# EAGLE design M8-Level (EAGLE 9.5.2)
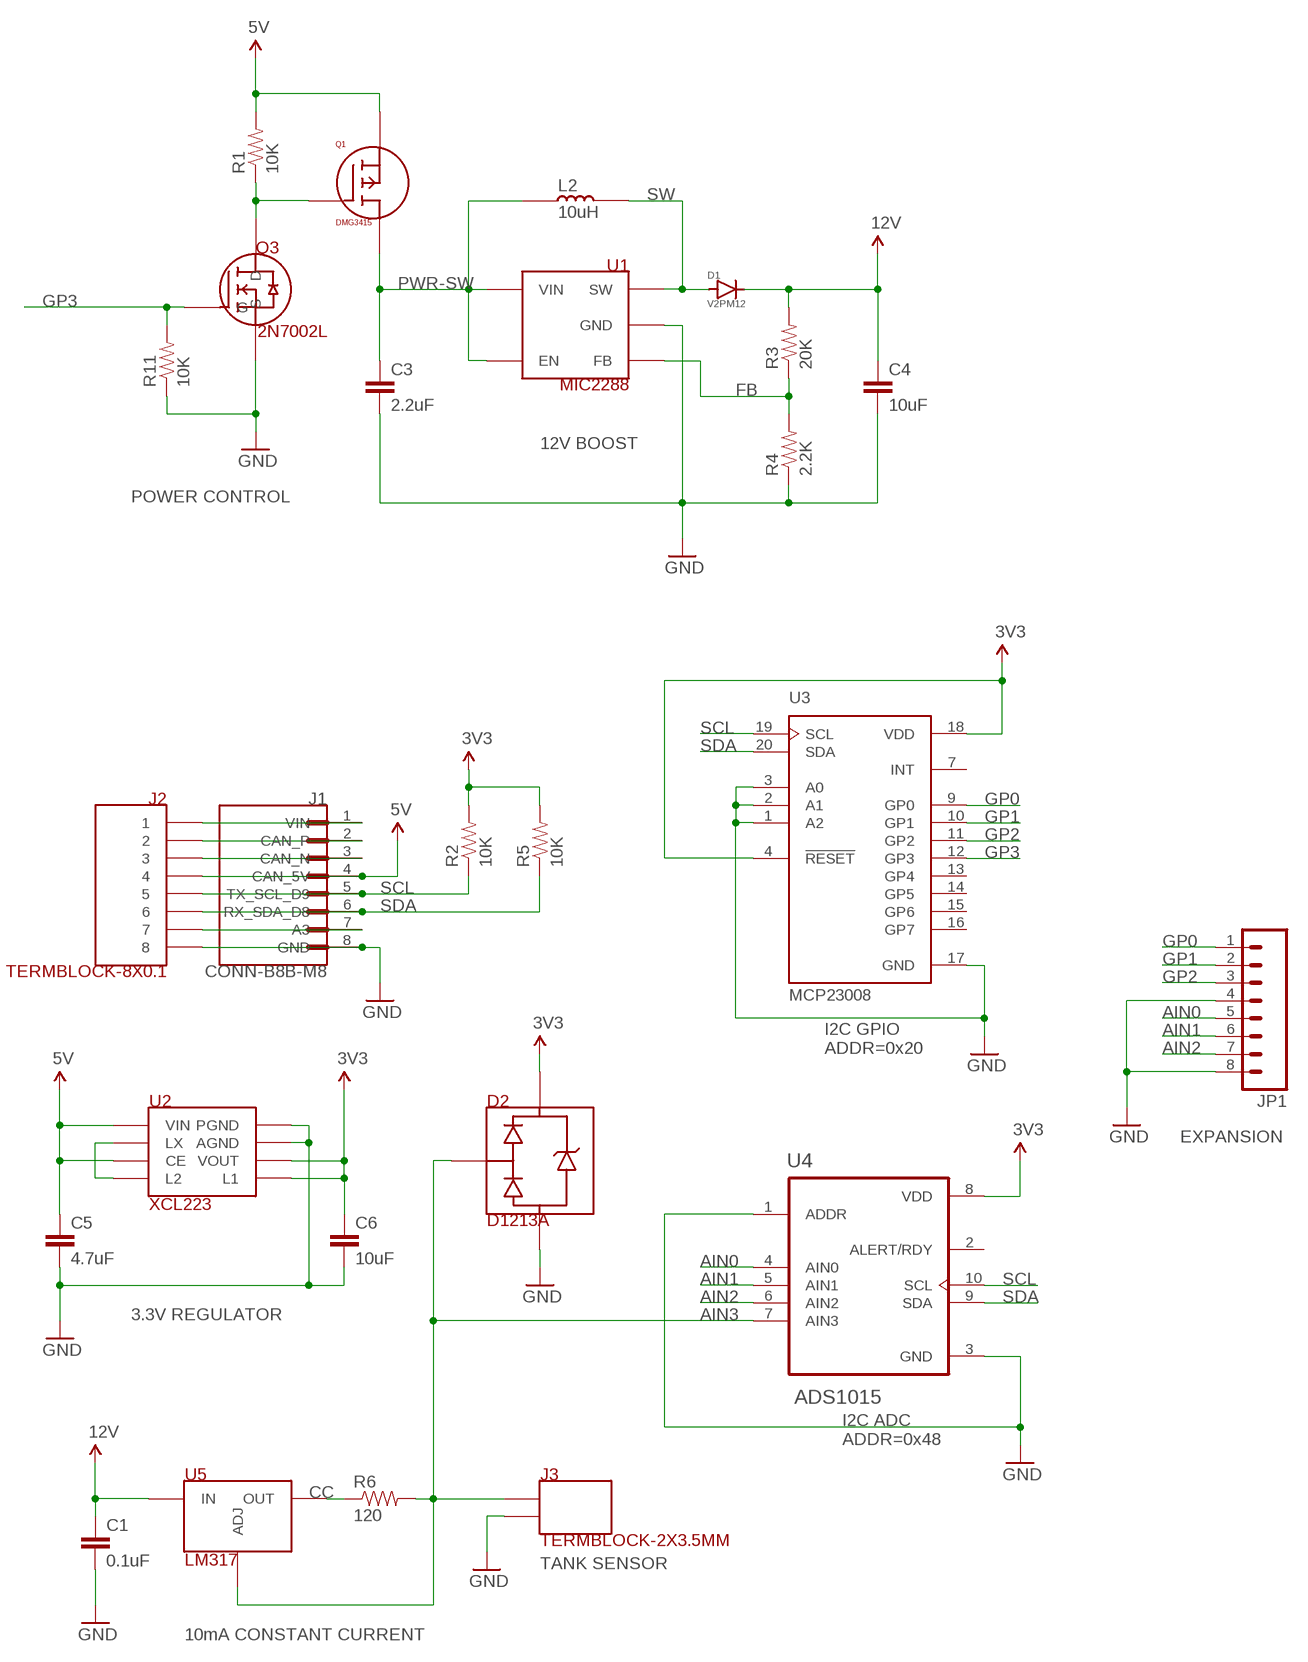
[diagram p0: schematic, sheet 1]

## Parts
C1  0.1uF  CAP-0.1UF-0603  [0603-CAP]
C3  2.2uF  CAP-2.2UF-0603  [0603-CAP]
C4  10uF  CAP-10UF-0603  [0603-CAP]
C5  4.7uF  CAP-4.7UF-0603  [0603-CAP]
C6  10uF  CAP-10UF-0603  [0603-CAP]
D1  V2PM12  V2PM12-SHOTTKY-DIODE  [DO-219AD-VISHAY]
D2  D1213A  D1213A-DLP  [DLP]
J1  CONN-B8B-M8  [JST_B8B-PH-SM4-TB(LF)(SN)]
J2  TERMBLOCK-8X0.1  [TERMBLOCK-8X0.1]
J3  TERMBLOCK-2X3.5MM  [TERMBLOCK-2X3.5MM]
JP1  M08SILK_FEMALE_PTH  [1X08]
L2  10uH  INDUCTOR-10UH  [BOURNS-INDUCTOR-3X3]
Q1  DMG3415  BS250-P-MOSFET  [2N7002L]
Q3  2N7002L  [2N7002L]
R1  10K  RES-10K-06030603  [0603-RES]
R2  10K  RES-10K-06030603  [0603-RES]
R3  20K  RES-20K-06030603  [0603-RES]
R4  2.2K  RES-2.2K-06030603  [0603-RES]
R5  10K  RES-10K-06030603  [0603-RES]
R6  120  RES-120-0603  [0603-RES]
R11  10K  RES-10K-06030603  [0603-RES]
U1  MIC2288  [TSOT23-5-MICROCHIP]
U2  XCL223  REG-XCL223  [REG-XCL223-LESS-CREAM]
U3  MCP23008  MCP23008T-E/ML  [QFN21P50_400X400X100L40X24T270N]
U4  ADS1015  ADS1015IDGSR  [SOP50P490X110-10N]
U5  LM317  [8-SOIC-ON751]

## Nets
3V3: C6.1 D2.VCC R2.2 R5.2 U2.3(VOUT) U2.7(L1) U3.4(!RESET) U3.18(VDD) U4.8(VDD)
5V: C5.1 J1.4(CAN_5V) J2.P$4 Q1.2(S) R1.2 U2.4(CE) U2.6(VIN)
12V: C1.1 C4.1 D1.C(CATHODE) R3.2 U5.1(IN)
A3: J1.7(A3) J2.P$7
AIN0: JP1.5 U4.4(AIN0)
AIN1: JP1.6 U4.5(AIN1)
AIN2: JP1.7 U4.6(AIN2)
AIN3: D2.SIGNAL J3.1 R6.2 U4.7(AIN3) U5.4(ADJ)
CAN_N: J1.3(CAN_N) J2.P$3
CAN_P: J1.2(CAN_P) J2.P$2
CC: R6.1 U5.2(OUT) U5.3(OUT) U5.6(OUT) U5.7(OUT)
FB: R3.1 R4.2 U1.3(FB)
GND: C1.2 C3.2 C4.2 C5.2 C6.2 D2.GND J1.8(GND) J2.P$8 J3.2 JP1.4 JP1.8 Q3.2(S) R4.1 R11.1 U1.2(GND) U2.1(PGND) U2.2(AGND) U3.1(A2) U3.2(A1) U3.3(A0) U3.17(GND) U4.1(ADDR) U4.3(GND)
GP0: JP1.1 U3.9(GP0)
GP1: JP1.2 U3.10(GP1)
GP2: JP1.3 U3.11(GP2)
GP3: Q3.1(G) R11.2 U3.12(GP3)
LX1: U2.5(LX) U2.8(L2)
PWR-SW: C3.1 L2.1 Q1.3(D) U1.4(EN) U1.5(VIN)
PWRCTL: Q1.1(G) Q3.3(D) R1.1
SCL: J1.5(TX_SCL_D9) J2.P$5 R2.1 U3.19(SCL) U4.10(SCL)
SDA: J1.6(RX_SDA_D8) J2.P$6 R5.1 U3.20(SDA) U4.9(SDA)
SW: D1.A(ANODE) L2.2 U1.1(SW)
VIN: J1.1(VIN) J2.P$1
Unconnected: U3.7(INT) U3.13(GP4) U3.14(GP5) U3.15(GP6) U3.16(GP7) U4.2(ALERT/RDY)

## Notes on the sheet
- 12V BOOST
- POWER CONTROL
- I2C GPIO
  ADDR=0x20
- EXPANSION
- 3.3V REGULATOR
- I2C ADC
  ADDR=0x48
- TANK SENSOR
- 10mA CONSTANT CURRENT

## Library data of the parts
C1 = rickk2:CAP-0.1UF-0603: CAP CER 0.1UF 16V X7R 0603 https://www.digikey.com/product-detail/en/murata-electronics-north-america/GRM188R71C104KA01D/490-1532-1-ND/587771
C3 = rickk2:CAP-2.2UF-0603: Murata Electronics North America GRM188R61E225KA12D CAP CER 2.2UF 25V X5R 0603 2.2µF ±10% 25V Ceramic Capacitor X5R 0603 (1608 Metric) https://www.digikey.com/product-detail/en/murata-electronics-north-america/GRM188R61E225KA12D/490-10731-1-ND/5251369
C4 C6 = rickk2:CAP-10UF-0603: CAP CER 10UF 16V X5R 0805 $ 0.21 https://www.digikey.com/product-detail/en/murata-electronics-north-america/GRM21BR61C106KE15L/490-3886-1-ND/965928
C5 = rickk2:CAP-4.7UF-0603: Murata X5R series CAP CER 4.7UF 6.3V X5R 0603 $0.12 https://www.digikey.com/product-detail/en/murata-electronics-north-america/GRM188R60J475KE19J/490-6407-1-ND/3845604
D1 = rickk2:V2PM12-SHOTTKY-DIODE: Vishay Semiconductor Diodes Division V2PM12HM3/H $0.35 DIODE SCHOTTKY 120V 2A MICROSMP Diode Schottky 120V 2A Surface Mount MicroSMP (DO-219AD) https://www.digikey.com/product-detail/en/vishay-semiconductor-diodes-division/V2PM12HM3-H/V2PM12HM3-HGICT-ND/7427199
D2 = rickk2:D1213A-DLP: Dataline protecvtion 3.3V - Zener + Rail-to-rail Diodes Incorporated D1213A-02SOL-7 $0.40 TVS DIODE 3.3V 10V SOT23 10V (Typ) Clamp 1A (8/20µs) Ipp Tvs Diode Surface Mount SOT-23 https://www.digikey.com/product-detail/en/diodes-incorporated/D1213A-02SOL-7/D1213A-02SOL-7DICT-ND/3340437 Ordered 10 2019-04-10 Left = Signal, Top = VCC, Bottom=GND
J1 = rickk2:CONN-B8B-M8: PH Series 2 mm Pitch 12 Position SMT Single Row Top Entry Shrouded Header
J2 = rickk2:TERMBLOCK-8X0.1: Term Block 8x0.1" 20-30AWG 6A 125V Max Side Entry On Shore Technology Inc. OSTVN08A150 TERM BLK 8P SIDE ENT 2.54MM PCB 8 Position Wire to Board Terminal Block Horizontal with Board 0.100" (2.54mm) Through Hole https://www.digikey.com/product-detail/en/on-shore-technology-inc/OSTVN08A150/ED10566-ND/1588868
J3 = rickk2:TERMBLOCK-2X3.5MM: TERM BLK 2POS SIDE ENT 3.5MM PCB $0.67 On Shore Technology Inc. OSTTE020161M https://www.digikey.com/products/en?keywords=ED2635-ND
JP1 = rickk2:M08: Sullins Connector Solutions PPTC081LFBN-RC $0.65 8 Position Header Connector Through Hole https://www.digikey.com/product-detail/en/sullins-connector-solutions/PPTC081LFBN-RC/S7006-ND/810147 Header 8 Standard 8-pin 0.1" header. Use with straight break away headers (SKU : PRT-00116), right angle break away headers (PRT-00553), swiss pins (PRT-00743), machine pins (PRT-00117), and female headers (PRT-00115).; PROD_ID: CONN-08438
L2 = rickk2:INDUCTOR-10UH: Bourns Inc. SRN3015-100M $0.46 FIXED IND 10UH 1A 276 MOHM SMD 10µH Semi-Shielded Wirewound Inductor 1A 276 mOhm Max Nonstandard https://www.digikey.com/product-detail/en/bourns-inc/SRN3015-100M/SRN3015-100MCT-ND/2756149
Q1 = rickk2:BS250-P-MOSFET: MOSFET P-CH 45V 0.09A SOT23-3 $0.77 Diodes Inc ber BS250FTA P-Channel 45V 90mA (Ta) 330mW (Ta) Surface Mount SOT-23-3 https://www.digikey.com/product-detail/en/diodes-incorporated/BS250FTA/BS250FCT-ND/53566 1=G (left) low=power on, use 100K pull-up for open-collector driving it 2=S = to VDD (top of symbol) 3=D = to load (bottom of symbol) Diodes Incorporated DMG3415U-7 MOSFET P-CH 20V 4A SOT-23 P-Channel 20V 4A (Ta) 900mW (Ta) Surface Mount SOT-23-3 https://www.digikey.com/product-detail/en/diodes-incorporated/DMG3415U-7/DMG3415UDICT-ND/2052799; VALUE: BS250
Q3 = rickk2:2N7002L: MOSFET N-CH 60V 0.115A SOT-23 $ 0.16 On Semicondutor 2N7002LT1G N-Channel 115mA (Tc) 225mW (Ta) Surface Mount SOT-23-3 (TO-236) https://www.digikey.com/product-detail/en/on-semiconductor/2N7002LT3G/2N7002LT3GOSCT-ND/2704932 1=G, high=D is connected to S (GND), the "on" state 2=S to GND (bottom of symbol) 3=D to load (top of symbol, pin on the side by itself) 2A version: Diodes Inc DMN6075S-7 MOSFET N-CH 60V 2A SOT23-3 $0.45 https://www.digikey.com/product-detail/en/diodes-incorporated/DMN6075S-7/DMN6075S-7DICT-ND/5149299 Old: https://www.digikey.com/product-detail/en/on-semiconductor/2N7002LT1G/2N7002LT1GOSCT-ND/917791
R1 R2 R5 R11 = rickk2:RES-10K-0603: RES SMD 10K OHM 5% 1/4W 0603 $ 0.10 https://www.digikey.com/product-detail/en/panasonic-electronic-components/ERJ-PA3J103V/P10KBZCT-ND/5036237
R3 = rickk2:RES-20K-0603: Panasonic Electronic Components ERJ-3EKF2002V $0.10 RES SMD 20K OHM 1% 1/10W 0603 20 kOhms ±1% 0.1W, 1/10W Chip Resistor 0603 (1608 Metric) Automotive AEC-Q200 Thick Film https://www.digikey.com/product-detail/en/panasonic-electronic-components/ERJ-3EKF2002V/P20.0KHCT-ND/198237
R4 = rickk2:RES-2.2K-0603: Panasonic Electronic Components ERJ-3EKF2201V RES SMD 2.2K OHM 1% 1/10W 0603 2.2 kOhms ±1% 0.1W, 1/10W Chip Resistor 0603 (1608 Metric) Automotive AEC-Q200 Thick Film https://www.digikey.com/product-detail/en/panasonic-electronic-components/ERJ-3EKF2201V/P2.20KHCT-ND/1746742
R6 = rickk2:RES-120-0603: Not ordered yet! Panasonic Electronic Components ERJ-3EKF1200V RES SMD 120 OHM 1% 1/10W 0603 120 Ohms ±1% 0.1W, 1/10W Chip Resistor 0603 (1608 Metric) Automotive AEC-Q200 Thick Film https://www.digikey.com/product-detail/en/panasonic-electronic-components/ERJ-3EKF1200V/P120HCT-ND/1746726
U1 = rickk2:MIC2288: Microchip Technology MIC2288YD5-TR $0.56 **don't have in stock** IC REG BOOST ADJ 1.2A TSOT23-5 Boost Switching Regulator IC Positive Adjustable 2.5V 1 Output 1.2A (Switch) SOT-23-5 Thin, TSOT-23-5 Originally ordered the wrong chip: https://www.digikey.com/product-detail/en/microchip-technology/MIC2619YD6-TR/576-3655-1-ND/2339666
U2 = rickk2:REG-XCL223: Manufacturer: Torex Semiconductor Ltd Manufacturer Part Number: XCL223A333D2-G DC DC CONVERTER 3.3V Detailed Description: Non-Isolated PoL Modul $2.63 https://www.digikey.com/product-detail/en/torex-semiconductor-ltd/XCL223A333D2-G/893-1416-1-ND/8256118 CIN=4.7uF 10V CL = 10uF 10V VIN MAX=5.5V VOUT=3.3V
U3 = rickk2:MCP23008T-E/ML: Not purchased yet Microchip Technology MCP23008T-E/ML $1.10 I/O Expander 8 I²C 1.7MHz 20-QFN-EP (4x4) https://www.digikey.com/product-detail/en/microchip-technology/MCP23008T-E-ML/MCP23008T-E-MLCT-ND/7916525 MCP23008 Series 5.5 V 1.7 MHz 8-Bit I/O Expander with Serial Interface - QFN-20; ARROW_ELECTRONICS-PURCHASE-URL: https://snapeda.com/shop?store=Arrow+Electronics&id=4816241; DESCRIPTION: IC I/O EXPANDER I2C 8B 20QFN; DIGIKEY-PURCHASE-URL: https://snapeda.com/shop?store=DigiKey&id=4816241; MF: Microchip Technology; MOUSER-PURCHASE-URL: https://snapeda.com/shop?store=Mouser&id=4816241; MP: MCP23008T-E/ML; PACKAGE: None
U4 = rickk2:ADS1015IDGSR: 12-Bit ADC with Integrated MUX, PGA, Comparator, Oscillator, and Reference 10-VSSOP -40 to 125; DESCRIPTION: 12 Bit Analog to Digital Converter 2, 4 Input 1 Sigma-Delta 10-VSSOP; DIGI-KEY_PART_NUMBER: 296-41185-1-ND; MF: Texas Instruments; MP: ADS1015IDGSR; PACKAGE: MSOP-10 Texas Instruments; TEXAS_INSTRUMENTS-PURCHASE-URL: https://snapeda.com/shop?store=Texas+Instruments&id=449361
U5 = rickk2:LM317: Not ordered yet ON Semiconductor LM317LDR2G $0.37 Linear Voltage Regulator IC 1 Output 100mA 8-SOIC https://www.digikey.com/product-detail/en/on-semiconductor/LM317LDR2G/LM317LDR2GOSCT-ND/917941

## Board
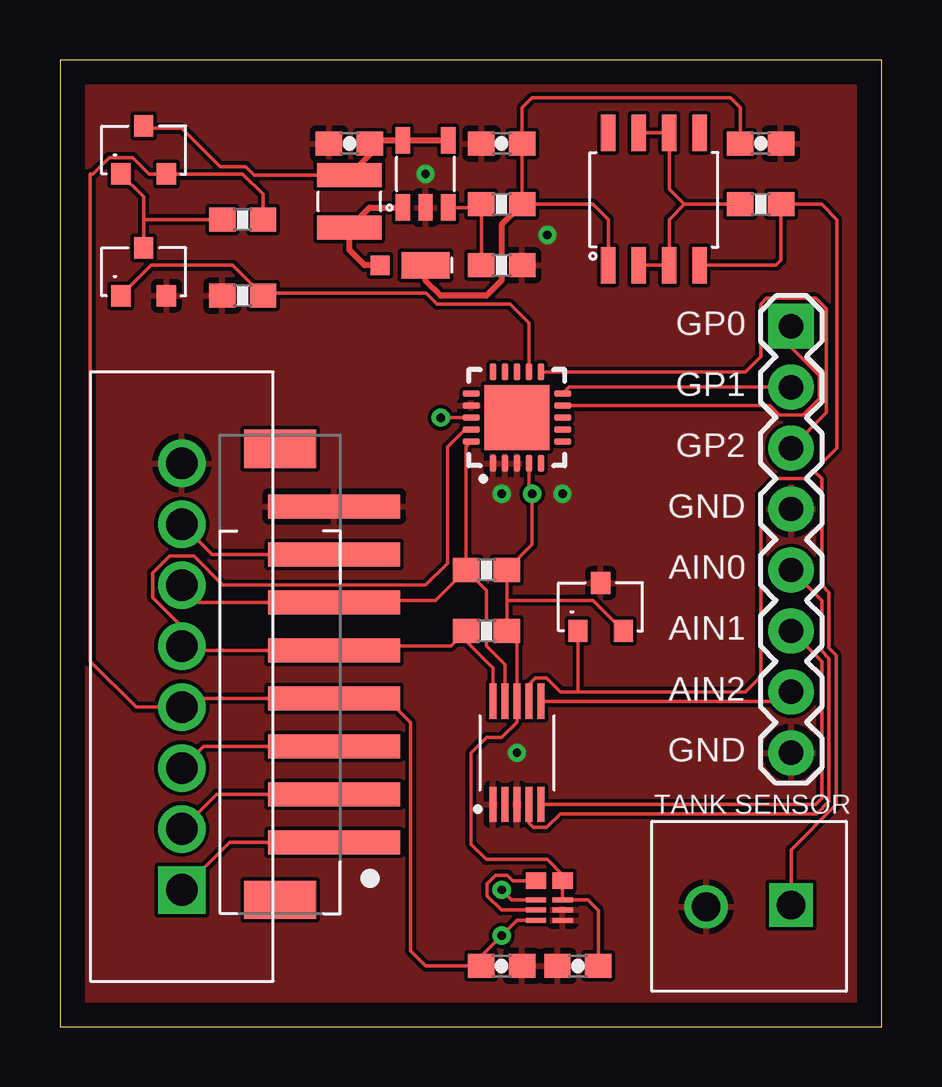
[diagram p1: board, top side]
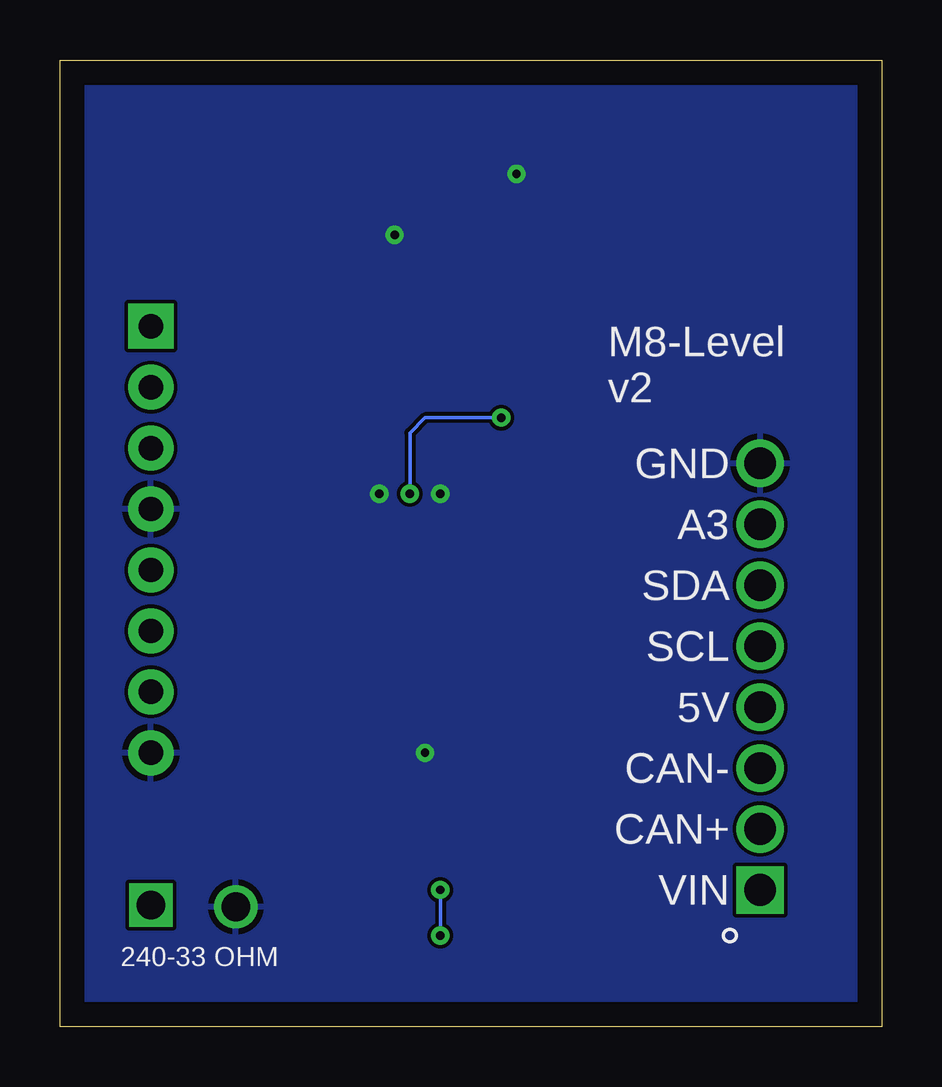
[diagram p2: board, bottom side, seen from below]

Size 34.27 x 40.31 mm. Coordinates in mm from the lower left corner, seen from the top.
Outline: 0,0 34.27,0 34.27,40.31 0,40.31 0,0
Copper layers (1*16): Top 0.035mm / dielectric 1.5mm / Bottom 0.035mm
Design rules "default": minimum track width 6mil, minimum drill 0.35mm, track to track 6mil, track to pad 6mil, pad to pad 6mil, via to via 6mil, smd to smd 6mil, copper to edge 40mil, drill to drill 6mil, minimum pad ring 10mil, minimum via ring 8mil, stop-mask expansion 4mil, vias tented up to drill 0mil, thermal gap 10mil

### Footprints (pad centres in the part's own frame; a part is rotated, then mirrored left to right if it is on the bottom)
0603-CAP = smd 1.1 x 1: 1 -0.85,0; 2 0.85,0
DO-219AD-VISHAY = smd 0.8 x 0.8: A 1.9,0 | smd 2 x 1.1: C 0,0
DLP = smd 0.8 x 0.9: GND 0.95,2; SIGNAL 0,0; VCC 1.9,0
JST_B8B-PH-SM4-TB(LF)(SN) = smd 1 x 5.5: 1 -5,0; 2 -3,0; 3 -1,0; 4 1,0; 5 3,0; 6 5,0; 7 7,0; 8 9,0 | smd 1.6 x 3: P1 -7.4,2.25; P2 11.4,2.25
TERMBLOCK-8X0.1 = drill 1.321 square: P$1 -8.89,0 | drill 1.321: P$2 -6.35,0; P$3 -3.81,0; P$4 -1.27,0; P$5 1.27,0; P$6 3.81,0; P$7 6.35,0; P$8 8.89,0
TERMBLOCK-2X3.5MM = drill 1.2 square: 1 0,0 | drill 1.2: 2 3.54,0.07
1X08 = drill 1.016 pad 1.88 square: 1 0,0 | drill 1.016 pad 1.88: 2 2.54,0; 3 5.08,0; 4 7.62,0; 5 10.16,0; 6 12.7,0; 7 15.24,0; 8 17.78,0
BOURNS-INDUCTOR-3X3 = smd 2.7 x 1: 1 0,1.1; 2 0,-1.1
2N7002L = smd 0.8 x 0.9: 1 0,0; 2 1.9,0; 3 0.95,2
0603-RES = smd 1.1 x 1: 1 -0.85,0; 2 0.85,0
TSOT23-5-MICROCHIP = smd 0.6 x 1.1: 1 -0.95,-1.4; 2 0,-1.4; 3 0.95,-1.4; 4 0.95,1.4; 5 -0.95,1.4
REG-XCL223-LESS-CREAM = smd 0.85 x 0.21: 1 0,0; 2 0,0.43; 3 0,0.86; 4 -1.11,0.86; 5 -1.11,0.43; 6 -1.11,0 | smd 0.85 x 0.7: 7 0,1.655; 8 -1.11,1.655
QFN21P50_400X400X100L40X24T270N = smd 0.71 x 0.26: 1 -1.905,1; 2 -1.905,0.5; 3 -1.905,0; 4 -1.905,-0.5; 5 -1.905,-1; 11 1.905,-1; 12 1.905,-0.5; 13 1.905,0; 14 1.905,0.5; 15 1.905,1 | smd 0.26 x 0.71: 6 -1,-1.905; 7 -0.5,-1.905; 8 0,-1.905; 9 0.5,-1.905; 10 1,-1.905; 16 1,1.905; 17 0.5,1.905; 18 0,1.905; 19 -0.5,1.905; 20 -1,1.905 | smd 2.7 x 2.7: 21 0,0
SOP50P490X110-10N = smd 1.47 x 0.28: 1 -2.15,1; 2 -2.15,0.5; 3 -2.15,0; 4 -2.15,-0.5; 5 -2.15,-1; 6 2.15,-1; 7 2.15,-0.5; 8 2.15,0; 9 2.15,0.5; 10 2.15,1
8-SOIC-ON751 = smd 0.6 x 1.52: 1 0,0; 2 1.27,0; 3 2.54,0; 4 3.81,0; 5 3.81,5.52; 6 2.54,5.52; 7 1.27,5.52; 8 0,5.52

### Placement (x,y rotation side)
C1  29.21,36.83 0 top
C3  12.06,36.83 180 top
C4  18.41,36.83 180 top
C5  18.41,2.54 0 top
C6  21.59,2.54 180 top
D1  15.24,31.75 180 top
D2  21.59,16.51 0 top
J1  11.43,12.7 90 top
J2  5.08,14.61 90 top
J3  30.48,5.08 180 top
JP1  30.48,29.21 270 top
L2  12.06,34.42 0 top
Q1  2.54,35.56 0 top
Q3  2.54,30.48 0 top
R1  7.62,33.66 0 top
R2  17.78,16.51 0 top
R3  18.41,34.29 0 top
R4  18.41,31.75 180 top
R5  17.78,19.05 0 top
R6  29.21,34.29 0 top
R11  7.62,30.48 0 top
U1  15.24,35.56 0 top
U2  20.95,4.45 0 top
U3  19.05,25.4 90 top
U4  19.05,11.43 90 top
U5  22.86,31.75 0 top

### Tracks (layer width: path | path; a pad name or v marks a point on that pad's centre or on a via)
3V3  (via drill 0.35)
  Top 0.152: C6.1 22.44,4.87 22,5.3 U2.3 U2.7 20.95,6.35 20.32,6.99 17.78,6.99 17.14,7.62 17.14,11.43 17.78,12.06 18.41,12.06 19.05,12.7 U4.8 19.05,16.09 R2.2 18.63,17.78 | v15.88,25.4 U3.18 | 18.63,17.78 R5.2 19.68,20.11 v19.68,22.23 19.55,22.36 U3.4 | D2.VCC 22.22,17.78 18.63,17.78
  Bottom 0.152: v15.88,25.4 19.05,25.4 19.68,24.77 v19.68,22.23
5V  (via drill 0.35)
  Top 0.152: U2.4 18.82,5.3 v18.41,5.71 | U2.6 19.05,4.45 v18.41,3.81 17.57,2.96 C5.1 15.24,2.54 14.61,3.17 14.61,12.7 13.61,13.7 J1.4 5.45,13.7 J2.P$4 3.17,13.34 1.27,15.24 1.27,35.56 1.37,35.56 2.04,36.24 3.04,36.24 3.71,35.56 Q1.2 7.62,35.56 8.47,34.71 R1.2
  Bottom 0.152: v18.41,5.71 v18.41,3.81
12V
  Top 0.152: U5.1 22.86,33.66 22.23,34.29 R3.2 C4.1 19.27,38.31 19.68,38.73 27.94,38.73 28.36,38.31 C1.1
  Top 0.254: R3.2 18.41,33.44 18.41,31.11 17.78,30.48 15.88,30.48 15.24,31.11 D1.C
A3
  Top 0.152: J1.7 6.33,19.7 J2.P$7
AIN0
  Top 0.152: JP1.5 31.75,17.78 31.75,15.67 32.05,15.37 32.05,9.4 31.55,8.89 20.86,8.89 20.29,8.32 19.75,8.32 19.55,8.51 U4.4
AIN1
  Top 0.152: U4.5 31.5,9.28 31.75,9.53 31.75,15.24 JP1.6
AIN2
  Top 0.152: U4.6 30.09,13.58 JP1.7
AIN3
  Top 0.152: 21.59,13.97 20.86,13.97 20.29,14.54 19.82,14.54 19.55,14.28 U4.7 | 21.59,13.97 28.57,13.97 29.21,14.61 29.21,22.23 29.84,22.86 31.11,22.86 31.43,23.18 | 31.43,23.18 32.38,24.13 32.38,33.66 31.75,34.29 R6.2 30.06,31.96 29.84,31.75 U5.4 | J3.1 30.48,7.39 32.36,9.27 32.36,15.49 32.05,15.8 32.05,18.11 31.75,18.41 31.75,22.86 31.43,23.18 | D2.SIGNAL 21.59,13.97
CAN_N
  Top 0.152: J1.3 5.99,11.7 J2.P$3
CAN_P
  Top 0.152: J1.2 6.53,9.7 J2.P$2
CC
  Top 0.152: U5.7 U5.6 25.4,34.92 26.04,34.29 | U5.2 U5.3 25.4,33.66 26.04,34.29 | 26.04,34.29 R6.1
FB
  Top 0.152: U1.3 17.43,34.16 R3.1 R4.2
GND  (via drill 0.35)
  other vias: 20.32,33.02 15.24,35.56 18.41,22.23 19.05,11.43 20.95,22.23
  pour Top: 0,0 0,44.45 43.18,44.45 43.18,0
  pour Bottom: 0,0 0,45.72 1.27,45.72 45.72,45.72 45.72,0
GP0
  Top 0.152: U3.9 29.6,25.9 30,25.5 30.96,25.5 31.65,26.19 31.65,27.15 30.48,28.32 JP1.1
GP1
  Top 0.152: U3.10 21.23,26.67 JP1.2
GP2
  Top 0.152: U3.11 28.57,27.3 29.21,27.94 29.21,30.14 29.45,30.38 31.51,30.38 31.95,29.94 31.95,25.6 JP1.3
GP3
  Top 0.152: Q3.1 3.81,31.75 7.2,31.75 8.36,30.59 | 8.36,30.59 R11.2 | U3.12 19.55,29.34 18.77,30.12 15.73,30.12 15.27,30.59 8.36,30.59
LX1
  Top 0.152: U2.8 18.89,6.1 18.67,6.32 18.16,6.32 17.81,5.97 17.81,5.46 18.4,4.88 U2.5
PWR-SW
  Top 0.152: L2.1 8.09,35.52 7.75,35.87 6.68,35.87 5.08,37.47 3.58,37.47 Q1.3
  Top 0.254: L2.1 12.91,36.37 C3.1 13.04,36.96 U1.5 U1.4
PWRCTL
  Top 0.152: Q3.3 3.49,33.66 | 3.49,33.66 3.49,34.61 Q1.1 | R1.1 3.49,33.66
SCL
  Top 0.152: U4.10 18.05,14.97 16.93,16.09 R2.1 16.3,15.88 11.61,15.88 J1.5 5.25,15.7 J2.P$5 5.08,16.69 3.86,17.91 3.86,18.92 4.58,19.63 5.58,19.63 6.79,18.43 14.28,18.43 14.29,18.41 15.24,18.41 16.15,19.33 16.15,24.17 16.88,24.9 U3.19
SDA
  Top 0.152: J2.P$6 5.79,17.7 J1.6 11.51,17.78 15.66,17.78 R5.1 | R5.1 16.93,24.18 U3.20 | R5.1 17.78,18.2 17.78,15.88 18.55,15.11 U4.9
SW
  Top 0.254: D1.A 12.7,31.75 12.06,32.38 L2.2 12.91,34.16 U1.1
VIN
  Top 0.152: J2.P$1 7.07,7.7 J1.1

### Text on the board
tPlace: GP0 | GP1 | GP2 | GND | AIN0 | AIN1 | AIN2 | GND | TANK SENSOR
bPlace: M8-Level / v2 | GND | A3 | SDA | SCL | 5V | CAN- | CAN+ | VIN | 240-33 OHM